# EAGLE schematic mp3player_v6_Laderegler_LTC4063 (EAGLE 9.2.0)
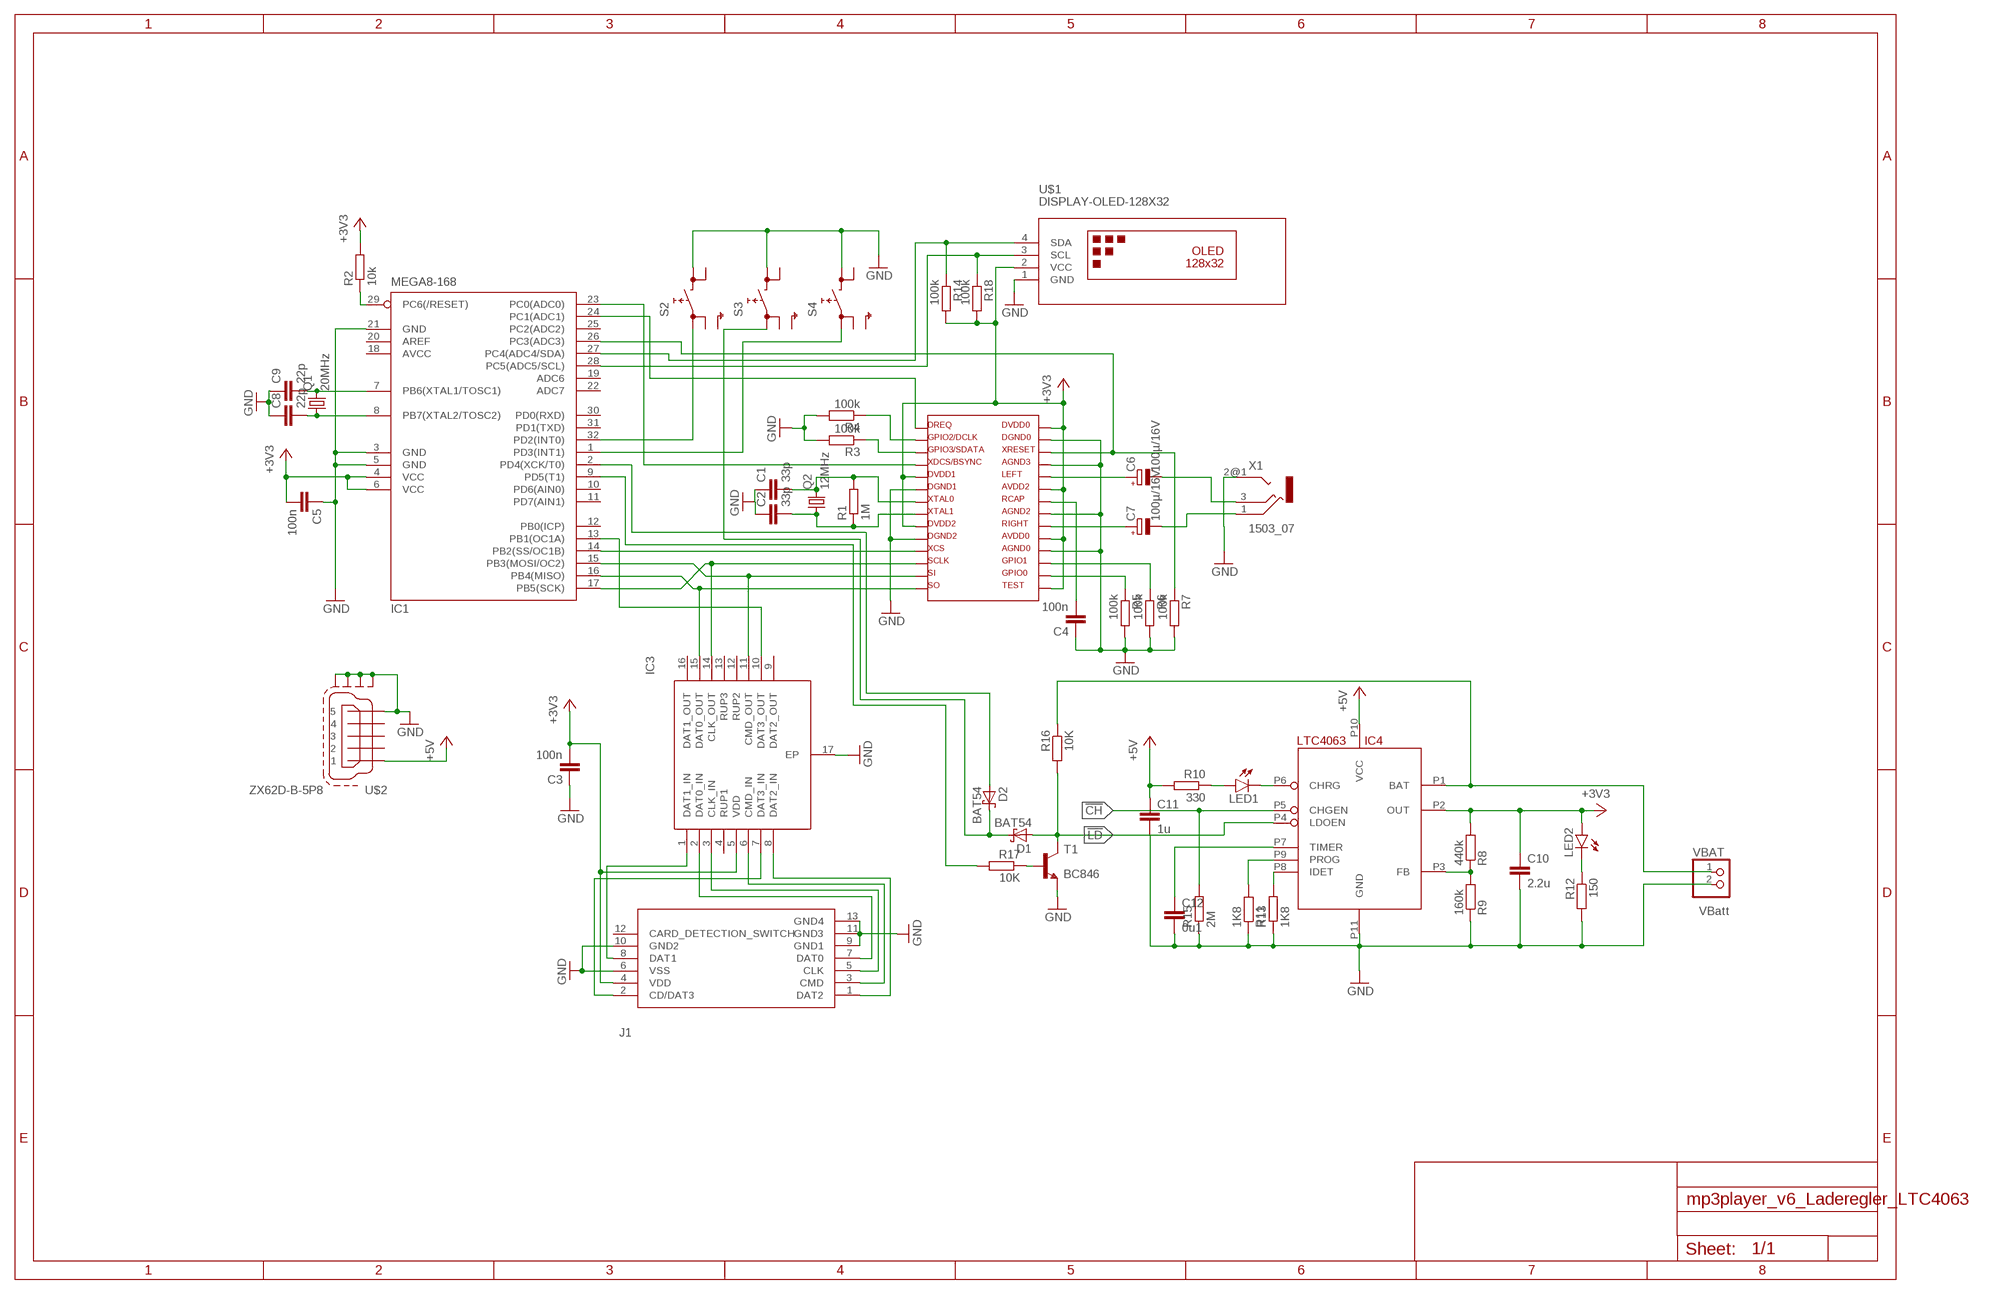
[diagram p0: schematic, sheet 1]

## Parts
C1  33p  C-EUC1206K  [C1206K]
C2  33p  C-EUC1206K  [C1206K]
C3  100n  C-EUC1206K  [C1206K]
C4  100n  C-EUC1206K  [C1206K]
C5  100n  C-EUC1206K  [C1206K]
C6  100µ/16V  CPOL-EUUD-6,3X7,7  [UD-6,3X7,7_NICHICON]
C7  100µ/16V  CPOL-EUUD-6,3X7,7  [UD-6,3X7,7_NICHICON]
C8  22p  C-EUC1206K  [C1206K]
C9  22p  C-EUC1206K  [C1206K]
C10  2.2u  C-EUC0805K  [C0805K]
C11  1u  C-EUC0805K  [C0805K]
C12  0u1  C-EUC0805K  [C0805K]
D1  BAT54  [SOT23]
D2  BAT54  [SOT23]
IC1  MEGA8-168  MEGA8-AI  [TQFP32-08]
IC2  VS1011  [SOIC-28]
IC3  ECLAMP2410P.TCT  [SON50P160X400X65-17N]
IC4  LTC4063  [LTC4063]
J1  DM3CS-SF  [DM3CS-SF]
LED1  LG_T679-E1F1-1  [PLCC2]
LED2  LG_T679-E1F1-1  [PLCC2]
Q1  20MHz  CRYSTALHC49UP  [HC49UP]
Q2  12MHz  CRYSTALHC49UP  [HC49UP]
R1  1M  R-EU_R0805  [R0805]
R2  10k  R-EU_0207/7  [0207/7]
R3  100k  R-EU_R0805  [R0805]
R4  100k  R-EU_R0805  [R0805]
R5  100k  R-EU_R0805  [R0805]
R6  100k  R-EU_R0805  [R0805]
R7  100k  R-EU_0207/15  [0207/15]
R8  440k  R-EU_R0805  [R0805]
R9  160k  R-EU_R0805  [R0805]
R10  330  R-EU_R0805  [R0805]
R11  1K8  R-EU_R0805  [R0805]
R12  150  R-EU_R0805  [R0805]
R13  1K8  R-EU_R0805  [R0805]
R14  100k  R-EU_R0805  [R0805]
R15  2M  R-EU_R0805  [R0805]
R16  10K  R-EU_0207/7  [0207/7]
R17  10K  R-EU_R0805  [R0805]
R18  100k  R-EU_R0805  [R0805]
S2  SKHMPSE010  [SKHMPXE010]
S3  SKHMPSE010  [SKHMPXE010]
S4  SKHMPSE010  [SKHMPXE010]
T1  BC846  [SOT23]
U$1  DISPLAY-OLED-128X32  [DISPLAY-OLED-128X32]
U$2  ZX62D-B-5P8  [ZX62D-B-5P8]
VBAT  PINHD-1X2  [1X02]
X1  1503_07  [1503_07]

## Nets
!CH: IC4.P5(CHGEN) R15.2
!LD: D1.1(A) IC4.P4(LDOEN) R16.2 T1.3(C)
+3V3: C3.2 C5.2 C10.1 IC1.4(VCC) IC1.6(VCC) IC2.5 IC2.9 IC2.15 IC2.19 IC2.23 IC2.28 IC3.5(VDD) IC4.P2(OUT) J1.4(VDD) LED2.A R2.2 R8.2 R14.2 R18.2 U$1.2(VCC)
+5V: C11.1 IC4.P10(VCC) R10.2 U$2.P$1
GND: C1.1 C2.1 C3.1 C4.1 C5.1 C8.1 C9.1 C10.2 C11.2 C12.2 IC1.3(GND) IC1.5(GND) IC1.21(GND) IC2.6 IC2.10 IC2.18 IC2.21 IC2.25 IC2.27 IC3.17(EP) IC4.P11(GND) J1.6(VSS) J1.9(GND1) J1.10(GND2) J1.11(GND3) J1.13(GND4) R3.2 R4.2 R5.2 R6.2 R7.2 R9.1 R11.1 R12.2 R13.1 R15.1 S2.3(2.1) S3.3(2.1) S4.3(2.1) T1.2(E) U$1.1(GND) U$2.P$5 U$2.SH1 U$2.SH2 U$2.SH3 U$2.SH4 VBAT.2 X1.2@1
N$1: IC1.17(PB5(SCK)) IC2.12 IC3.14(CLK_OUT)
N$2: IC1.16(PB4(MISO)) IC2.14 IC3.15(DAT0_OUT)
N$3: IC1.15(PB3(MOSI/OC2)) IC2.13 IC3.11(CMD_OUT)
N$4: IC1.14(PB2(SS/OC1B)) IC2.11
N$6: C2.2 IC2.8 Q2.1 R1.1
N$7: IC1.23(PC0(ADC0)) IC2.4
N$8: C4.2 IC2.22
N$9: IC2.3 R3.1
N$10: C1.2 IC2.7 Q2.2 R1.2
N$11: IC2.2 R4.1
N$12: IC1.32(PD2(INT0)) S2.1(1.1)
N$13: IC2.17 R6.1
N$14: IC2.16 R5.1
N$15: IC1.24(PC1(ADC1)) IC2.1
N$16: D2.1(A) IC1.2(PD4(XCK/T0))
N$17: IC1.26(PC3(ADC3)) IC2.26 R7.1
N$18: IC1.29(PC6(/RESET)) R2.1
N$19: C7.+ IC2.20
N$20: C6.+ IC2.24
N$21: IC1.1(PD3(INT1)) S4.1(1.1)
N$22: C6.- X1.3
N$23: C7.- X1.1
N$24: C8.2 IC1.8(PB7(XTAL2/TOSC2)) Q1.1
N$25: C9.2 IC1.7(PB6(XTAL1/TOSC1)) Q1.2
N$26: IC3.1(DAT1_IN) J1.8(DAT1)
N$27: IC3.8(DAT2_IN) J1.1(DAT2)
N$28: IC4.P3(FB) R8.1 R9.2
N$29: IC3.7(DAT3_IN) J1.2(CD/DAT3)
N$30: IC3.2(DAT0_IN) J1.7(DAT0)
N$31: IC3.3(CLK_IN) J1.5(CLK)
N$32: IC3.6(CMD_IN) J1.3(CMD)
N$33: IC4.P1(BAT) R16.1 VBAT.1
N$34: LED1.A R10.1
N$35: IC4.P9(PROG) R11.2
N$36: IC4.P6(CHRG) LED1.C
N$37: LED2.C R12.1
N$38: IC4.P8(IDET) R13.2
N$39: C12.1 IC4.P7(TIMER)
N$40: IC1.27(PC4(ADC4/SDA)) R14.1 U$1.4(SDA)
N$41: IC1.28(PC5(ADC5/SCL)) R18.1 U$1.3(SCL)
N$43: IC1.13(PB1(OC1A)) IC3.10(DAT3_OUT)
N$47: R17.1 T1.1(B)
N$49: IC1.9(PD5(T1)) R17.2
N$51: D1.3(C) D2.3(C) S3.1(1.1)
Unconnected: IC1.10(PD6(AIN0)) IC1.11(PD7(AIN1)) IC1.12(PB0(ICP)) IC1.19(ADC6) IC1.20(AREF) IC1.22(ADC7) IC1.25(PC2(ADC2)) IC1.30(PD0(RXD)) IC1.31(PD1(TXD)) IC3.4(RUP1) IC3.9(DAT2_OUT) IC3.12(RUP2) IC3.13(RUP3) IC3.16(DAT1_OUT) J1.12(CARD_DETECTION_SWITCH) S2.2(1.2) S2.4(2.2) S2.5(SH) S3.2(1.2) S3.4(2.2) S3.5(SH) S4.2(1.2) S4.4(2.2) S4.5(SH) U$2.P$2 U$2.P$3 U$2.P$4 X1.2@2

## Notes on the sheet
- VBatt

## Power pins joined to a net without a drawn wire
AVCC: IC1.18(AVCC)

## Library data of the parts
C1-C5 C10-C12 = rcl:C-EU: CAPACITOR, European symbol
C6 C7 = rcl:CPOL-EU: POLARIZED CAPACITOR, European symbol
C8 C9 = rcl:C-EU: CAPACITOR, European symbol; SPICEPREFIX: C
D1 D2 = diode:BAT54: Schottky Diodes Source: Fairchild .. BAT54.pdf
IC1 = atmel:MEGA8: MICROCONTROLLER 8 Kbytes FLASH, 1 kbytes SRAM, 512 bytes EEPROM, USART, 6-channel 10 bit ADC, 2-channel 8 bit ADC Pin compatible with Atmega48, ATMega88, ATMega168 Source: avr.lbr; MPN: ATMEGA8-16AU; OC_FARNELL: 9171371; OC_NEWARK: 73M8863
IC2 = vs10xx:VS1011
IC3 = SamacSys_Parts:ECLAMP2410P.TCT: EClamp ESD-EMI Protect T-Flash/MicroSD Semtech ECLAMP2410P.TCT, Hex Bi-Directional EMI Filter & ESD Protector, 16-Pin SLP EP Source: Datasheet <http://www.semtech.com/images/datasheet/eclamp2410p.pdf>; ARROW_PART_NUMBER: ECLAMP2410P.TCT; ARROW_PRICE/STOCK: https://www.arrow.com/en/products/eclamp2410p.tct/semtech; DESCRIPTION: EClamp ESD-EMI Protect T-Flash/MicroSD Semtech ECLAMP2410P.TCT, Hex Bi-Directional EMI Filter & ESD Protector, 16-Pin SLP EP; HEIGHT: 0.65mm; MANUFACTURER_NAME: SEMTECH; MANUFACTURER_PART_NUMBER: ECLAMP2410P.TCT; RS_PART_NUMBER: 6910638; RS_PRICE/STOCK: http://uk.rs-online.com/web/p/products/6910638
IC4 = LinearTechnology:LTC4063: LTC4063 - Standalone Linear Li-Ion Charger with Micropower Low Dropout Linear Regulator The LTC®4063 is a standalone linear charger for single cell lithium-ion batteries with an adjustable low dropout linear regulator (LDO). The adjustable LDO regulates an output voltage between 1.2V to 4.2V at up to 100mA load cur- rent. When the input supply (wall adapter or USB supply) is removed, the LDO regulates the output voltage without interruption. The battery charger and LDO regulator can be enabled individually. No external sense resistor or external blocking diode is required for charging due to the internal MOSFET archi- tecture. For more details have a look at the data sheet <http://cds.linear.com/docs/en/datasheet/4063fc.pdf>. Copyright (c) 2013, Michael Hohl <http://www.michaelhohl.net>
J1 = SamacSys_Parts:DM3CS-SF: MicroSD card connector, push-pull type MicroSD card connector, push-pull type Source: Datasheet <http://docs-europe.electrocomponents.com/webdocs/118f/0900766b8118f8bb.pdf>; ARROW_PART_NUMBER: DM3CS-SF; ARROW_PRICE/STOCK: https://www.arrow.com/en/products/dm3cs-sf/hirose-electric; DESCRIPTION: MicroSD card connector, push-pull type MicroSD card connector, push-pull type; HEIGHT: mm; MANUFACTURER_NAME: Hirose; MANUFACTURER_PART_NUMBER: DM3CS-SF; RS_PART_NUMBER: 1664833; RS_PRICE/STOCK: http://uk.rs-online.com/web/p/products/1664833
LED1 LED2 = led:*_T679-?-1: LC TOPLED® Low Current LED Source: http://catalog.osram-os.com .. LG_LS_LY_T679_OBS.pdf; COLOR: green
Q1 = crystal:CRYSTAL: CRYSTAL; OC_FARNELL: unknown; OC_NEWARK: unknown
Q2 = crystal:CRYSTAL: CRYSTAL
R1-R10 R12-R18 = rcl:R-EU_: RESISTOR, European symbol; SPICEPREFIX: R
R11 = rcl:R-EU_: RESISTOR, European symbol
S2-S4 = switch:SKHMP*E010: 6.2 X 6.5mm TACT Switch (SMD) Source: http://www3.alps.co.jp/WebObjects/catalog.woa/PDF/E/Switch/Tact/SKHM/SKHM.PDF
T1 = transistor-neu-to92:BC846: NPN TRANSISTOR
U$1 = diy-modules:DISPLAY-OLED-128X32: 128x32 Dot Matrix OLED Module with I2C interface based on SSD1306 chip More details available here: http://www.tinyosshop.com/index.php?route=product/product&product_id=953 Schematic available here: http://www.tinyosshop.com/datasheet/OLED%2012832.pdf SSD1306 datasheet: https://cdn-shop.adafruit.com/datasheets/SSD1306.pdf Click here to find device on ebay.com <http://www.ebay.com/sch/oled+display+128x32+i2c>
U$2 = j_usb_hirose_zx62d-b-5p8:ZX62D-B-5P8: Hirose ZX62D-B-5P8 Micro-B USB connector, standard mount location, with through-hold shell tabs and SMD pins.
VBAT = pinhead:PINHD-1X2: PIN HEADER
X1 = con-lumberg:1503_?: Jack connectors according to JISC 6560, 3.5 mm Klinkensteckverbinder nach JISC 6560, 3,5 mm Source: http://www.lumberg.com/Produkte/PDFs/1503_08.pdf; OC_FARNELL: unknown; OC_NEWARK: unknown